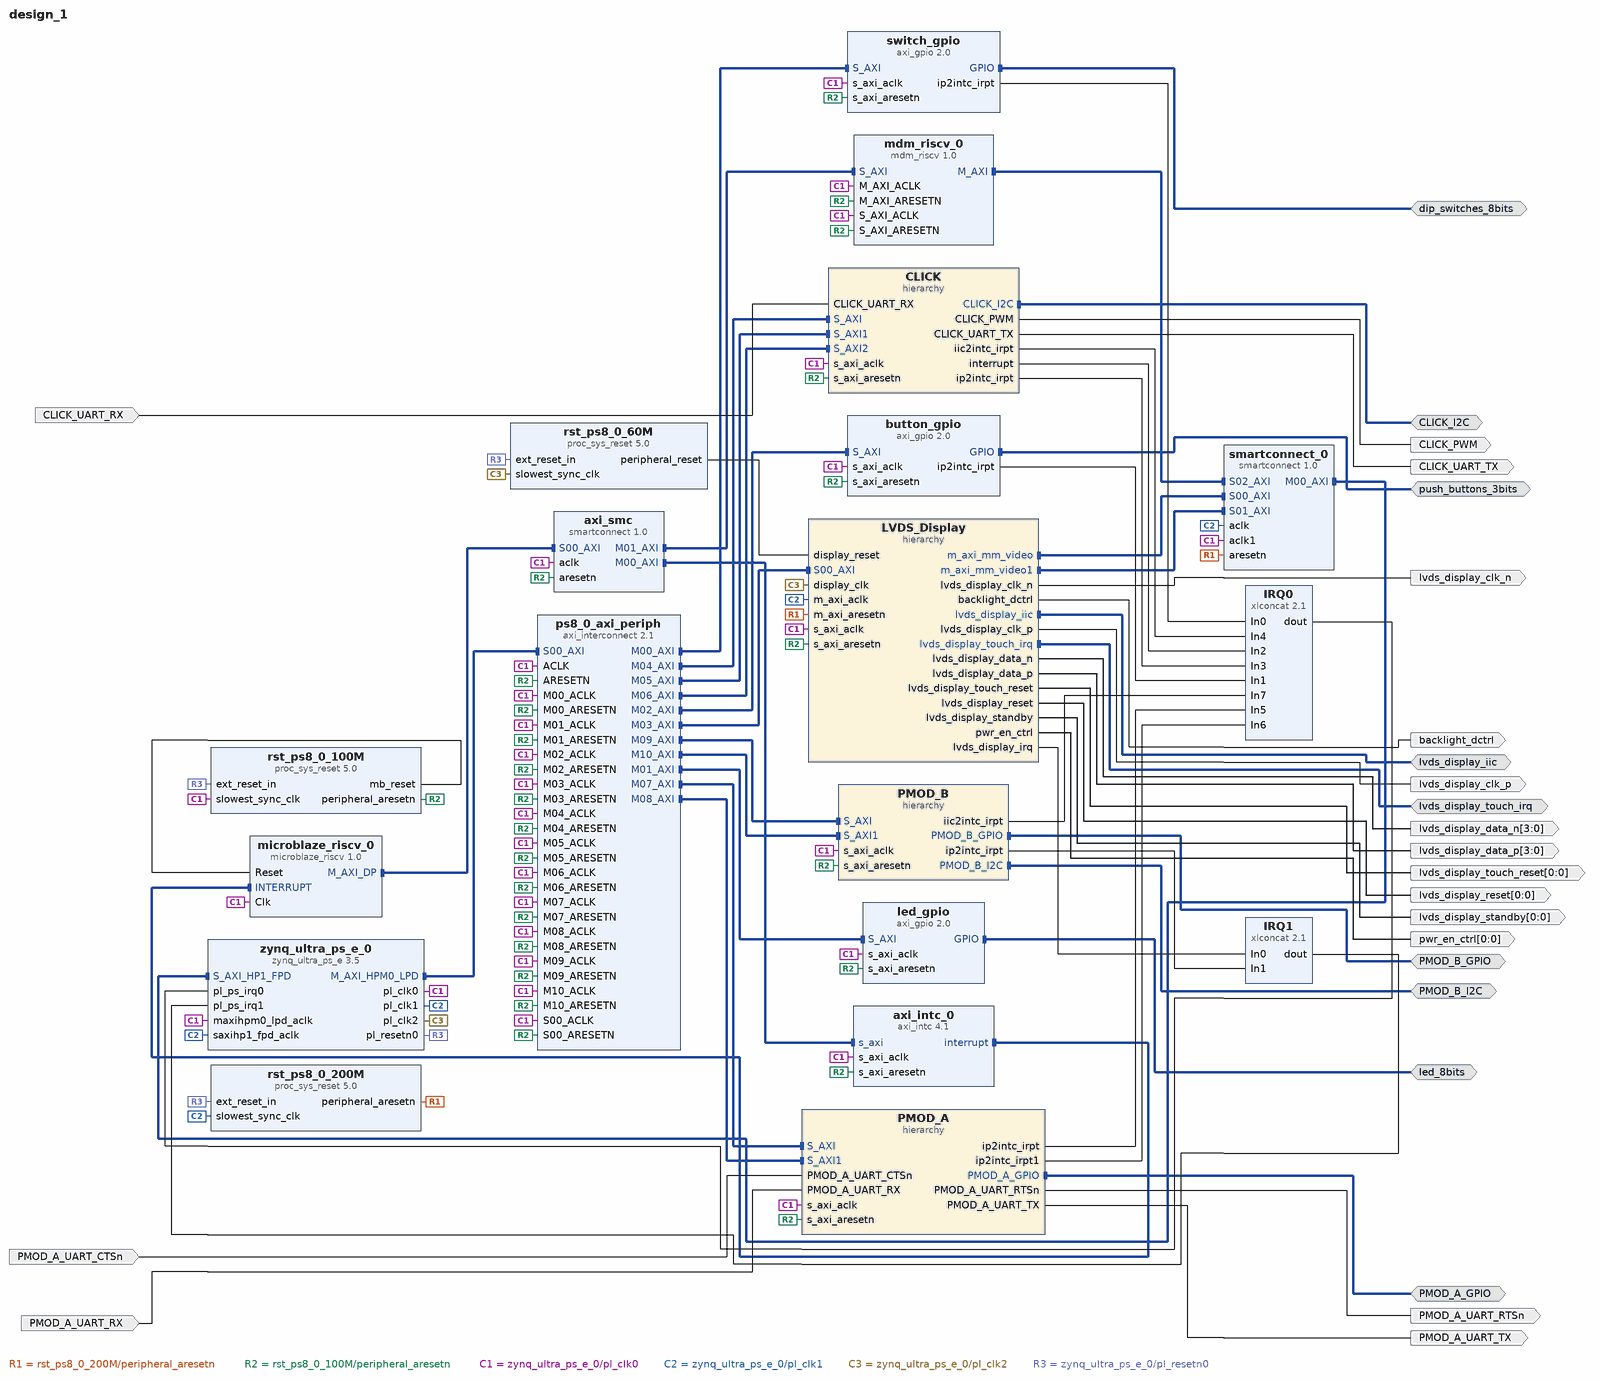
[diagram p0: block diagram of the top level]
# Vivado block design design_1, xczu3eg-sfvc784-1-e, Vivado 2025.1
create_bd_design design_1

create_bd_intf_port -mode Master -vlnv xilinx.com:interface:gpio_rtl:1.0 dip_switches_8bits
create_bd_intf_port -mode Master -vlnv xilinx.com:interface:gpio_rtl:1.0 led_8bits
create_bd_intf_port -mode Master -vlnv xilinx.com:interface:gpio_rtl:1.0 push_buttons_3bits
create_bd_intf_port -mode Master -vlnv xilinx.com:interface:iic_rtl:1.0 lvds_display_iic
create_bd_intf_port -mode Master -vlnv xilinx.com:interface:iic_rtl:1.0 CLICK_I2C
create_bd_intf_port -mode Master -vlnv xilinx.com:interface:iic_rtl:1.0 PMOD_B_I2C
create_bd_intf_port -mode Master -vlnv xilinx.com:interface:gpio_rtl:1.0 PMOD_A_GPIO
create_bd_intf_port -mode Master -vlnv xilinx.com:interface:gpio_rtl:1.0 PMOD_B_GPIO
create_bd_intf_port -mode Master -vlnv xilinx.com:interface:gpio_rtl:1.0 lvds_display_touch_irq
create_bd_port -dir O lvds_display_clk_n
create_bd_port -dir O lvds_display_clk_p
create_bd_port -dir O -from 3 -to 0 lvds_display_data_n
create_bd_port -dir O -from 3 -to 0 lvds_display_data_p
create_bd_port -dir O -from 0 -to 0 lvds_display_reset
create_bd_port -dir O -from 0 -to 0 lvds_display_standby
create_bd_port -dir I PMOD_A_UART_RX
create_bd_port -dir O PMOD_A_UART_TX
create_bd_port -dir I PMOD_A_UART_CTSn
create_bd_port -dir O PMOD_A_UART_RTSn
create_bd_port -dir O backlight_dctrl
create_bd_port -dir O -from 0 -to 0 pwr_en_ctrl
create_bd_port -dir O CLICK_PWM
create_bd_port -dir I CLICK_UART_RX
create_bd_port -dir O CLICK_UART_TX
create_bd_port -dir O -from 0 -to 0 lvds_display_touch_reset

create_bd_cell -type ip -vlnv xilinx.com:ip:proc_sys_reset:5.0 rst_ps8_0_100M
create_bd_cell -type hier LVDS_Display
create_bd_cell -type ip -vlnv xilinx.com:ip:proc_sys_reset:5.0 rst_ps8_0_200M
create_bd_cell -type ip -vlnv xilinx.com:ip:proc_sys_reset:5.0 rst_ps8_0_60M
create_bd_cell -type hier CLICK
create_bd_cell -type hier PMOD_A
create_bd_cell -type hier PMOD_B
create_bd_cell -type ip -vlnv xilinx.com:ip:xlconcat:2.1 IRQ0
set_property -dict {CONFIG.IN2_WIDTH 1 CONFIG.NUM_PORTS 8 CONFIG.dout_width 8} [get_bd_cells IRQ0]
create_bd_cell -type ip -vlnv xilinx.com:ip:xlconcat:2.1 IRQ1
set_property -dict {CONFIG.dout_width 8} [get_bd_cells IRQ1]
create_bd_cell -type ip -vlnv xilinx.com:ip:axi_gpio:2.0 switch_gpio
set_property -dict [list \
  CONFIG.C_INTERRUPT_PRESENT 1 \
  CONFIG.GPIO_BOARD_INTERFACE dip_switches_8bits \
  CONFIG.USE_BOARD_FLOW true \
] [get_bd_cells switch_gpio]
create_bd_cell -type ip -vlnv xilinx.com:ip:axi_gpio:2.0 led_gpio
set_property -dict {CONFIG.GPIO_BOARD_INTERFACE led_8bits CONFIG.USE_BOARD_FLOW true} [get_bd_cells led_gpio]
create_bd_cell -type ip -vlnv xilinx.com:ip:axi_gpio:2.0 button_gpio
set_property -dict [list \
  CONFIG.C_INTERRUPT_PRESENT 1 \
  CONFIG.GPIO_BOARD_INTERFACE push_buttons_3bits \
  CONFIG.USE_BOARD_FLOW true \
] [get_bd_cells button_gpio]
create_bd_cell -type ip -vlnv xilinx.com:ip:axi_interconnect:2.1 ps8_0_axi_periph
set_property -dict {CONFIG.NUM_MI 11} [get_bd_cells ps8_0_axi_periph]
create_bd_cell -type ip -vlnv xilinx.com:ip:smartconnect:1.0 smartconnect_0
set_property -dict {CONFIG.NUM_CLKS 2 CONFIG.NUM_SI 3} [get_bd_cells smartconnect_0]
create_bd_cell -type ip -vlnv xilinx.com:ip:zynq_ultra_ps_e:3.5 zynq_ultra_ps_e_0
set_property -dict [list \
  CONFIG.CAN0_BOARD_INTERFACE custom \
  CONFIG.CAN1_BOARD_INTERFACE custom \
  CONFIG.CSU_BOARD_INTERFACE custom \
  CONFIG.DP_BOARD_INTERFACE custom \
  CONFIG.GEM0_BOARD_INTERFACE custom \
  CONFIG.GEM1_BOARD_INTERFACE custom \
  CONFIG.GEM2_BOARD_INTERFACE custom \
  CONFIG.GEM3_BOARD_INTERFACE custom \
  CONFIG.GPIO_BOARD_INTERFACE custom \
  CONFIG.IIC0_BOARD_INTERFACE custom \
  CONFIG.IIC1_BOARD_INTERFACE custom \
  CONFIG.NAND_BOARD_INTERFACE custom \
  CONFIG.PCIE_BOARD_INTERFACE custom \
  CONFIG.PJTAG_BOARD_INTERFACE custom \
  CONFIG.PMU_BOARD_INTERFACE custom \
  CONFIG.PSU_BANK_0_IO_STANDARD LVCMOS33 \
  CONFIG.PSU_BANK_1_IO_STANDARD LVCMOS33 \
  CONFIG.PSU_BANK_2_IO_STANDARD LVCMOS33 \
  CONFIG.PSU_BANK_3_IO_STANDARD LVCMOS18 \
  CONFIG.PSU_USB3__DUAL_CLOCK_ENABLE 1 \
  CONFIG.PSU__CAN1__PERIPHERAL__ENABLE 0 \
  CONFIG.PSU__CRF_APB__ACPU_CTRL__FREQMHZ 1100 \
  CONFIG.PSU__CRF_APB__ACPU_CTRL__SRCSEL APLL \
  CONFIG.PSU__CRF_APB__APLL_CTRL__SRCSEL PSS_REF_CLK \
  CONFIG.PSU__CRF_APB__DBG_FPD_CTRL__FREQMHZ 250 \
  CONFIG.PSU__CRF_APB__DBG_FPD_CTRL__SRCSEL IOPLL \
  CONFIG.PSU__CRF_APB__DBG_TRACE_CTRL__FREQMHZ 250 \
  CONFIG.PSU__CRF_APB__DBG_TRACE_CTRL__SRCSEL IOPLL \
  CONFIG.PSU__CRF_APB__DBG_TSTMP_CTRL__FREQMHZ 250 \
  CONFIG.PSU__CRF_APB__DBG_TSTMP_CTRL__SRCSEL IOPLL \
  CONFIG.PSU__CRF_APB__DDR_CTRL__FREQMHZ 534 \
  CONFIG.PSU__CRF_APB__DDR_CTRL__SRCSEL DPLL \
  CONFIG.PSU__CRF_APB__DPDMA_REF_CTRL__FREQMHZ 550 \
  CONFIG.PSU__CRF_APB__DPDMA_REF_CTRL__SRCSEL APLL \
  CONFIG.PSU__CRF_APB__DPLL_CTRL__SRCSEL PSS_REF_CLK \
  CONFIG.PSU__CRF_APB__DP_AUDIO_REF_CTRL__SRCSEL RPLL \
  CONFIG.PSU__CRF_APB__DP_STC_REF_CTRL__SRCSEL RPLL \
  CONFIG.PSU__CRF_APB__DP_VIDEO_REF_CTRL__SRCSEL VPLL \
  CONFIG.PSU__CRF_APB__GDMA_REF_CTRL__FREQMHZ 550 \
  CONFIG.PSU__CRF_APB__GDMA_REF_CTRL__SRCSEL APLL \
  CONFIG.PSU__CRF_APB__GPU_REF_CTRL__FREQMHZ 500 \
  CONFIG.PSU__CRF_APB__GPU_REF_CTRL__SRCSEL IOPLL \
  CONFIG.PSU__CRF_APB__TOPSW_LSBUS_CTRL__FREQMHZ 100 \
  CONFIG.PSU__CRF_APB__TOPSW_LSBUS_CTRL__SRCSEL IOPLL \
  CONFIG.PSU__CRF_APB__TOPSW_MAIN_CTRL__FREQMHZ 475 \
  CONFIG.PSU__CRF_APB__TOPSW_MAIN_CTRL__SRCSEL DPLL \
  CONFIG.PSU__CRF_APB__VPLL_CTRL__SRCSEL PSS_REF_CLK \
  CONFIG.PSU__CRL_APB__ADMA_REF_CTRL__FREQMHZ 500 \
  CONFIG.PSU__CRL_APB__ADMA_REF_CTRL__SRCSEL IOPLL \
  CONFIG.PSU__CRL_APB__CAN1_REF_CTRL__FREQMHZ 100 \
  CONFIG.PSU__CRL_APB__CAN1_REF_CTRL__SRCSEL IOPLL \
  CONFIG.PSU__CRL_APB__CPU_R5_CTRL__FREQMHZ 500 \
  CONFIG.PSU__CRL_APB__CPU_R5_CTRL__SRCSEL IOPLL \
  CONFIG.PSU__CRL_APB__DBG_LPD_CTRL__FREQMHZ 250 \
  CONFIG.PSU__CRL_APB__DBG_LPD_CTRL__SRCSEL IOPLL \
  CONFIG.PSU__CRL_APB__GEM3_REF_CTRL__FREQMHZ 125 \
  CONFIG.PSU__CRL_APB__GEM3_REF_CTRL__SRCSEL IOPLL \
  CONFIG.PSU__CRL_APB__I2C0_REF_CTRL__FREQMHZ 100 \
  CONFIG.PSU__CRL_APB__I2C0_REF_CTRL__SRCSEL IOPLL \
  CONFIG.PSU__CRL_APB__I2C1_REF_CTRL__FREQMHZ 100 \
  CONFIG.PSU__CRL_APB__I2C1_REF_CTRL__SRCSEL IOPLL \
  CONFIG.PSU__CRL_APB__IOPLL_CTRL__SRCSEL PSS_REF_CLK \
  CONFIG.PSU__CRL_APB__IOU_SWITCH_CTRL__FREQMHZ 250 \
  CONFIG.PSU__CRL_APB__IOU_SWITCH_CTRL__SRCSEL IOPLL \
  CONFIG.PSU__CRL_APB__LPD_LSBUS_CTRL__FREQMHZ 100 \
  CONFIG.PSU__CRL_APB__LPD_LSBUS_CTRL__SRCSEL IOPLL \
  CONFIG.PSU__CRL_APB__LPD_SWITCH_CTRL__FREQMHZ 500 \
  CONFIG.PSU__CRL_APB__LPD_SWITCH_CTRL__SRCSEL IOPLL \
  CONFIG.PSU__CRL_APB__PCAP_CTRL__FREQMHZ 200 \
  CONFIG.PSU__CRL_APB__PCAP_CTRL__SRCSEL RPLL \
  CONFIG.PSU__CRL_APB__PL0_REF_CTRL__FREQMHZ 100 \
  CONFIG.PSU__CRL_APB__PL0_REF_CTRL__SRCSEL IOPLL \
  CONFIG.PSU__CRL_APB__PL1_REF_CTRL__FREQMHZ 200 \
  CONFIG.PSU__CRL_APB__PL2_REF_CTRL__FREQMHZ 60 \
  CONFIG.PSU__CRL_APB__QSPI_REF_CTRL__FREQMHZ 125 \
  CONFIG.PSU__CRL_APB__QSPI_REF_CTRL__SRCSEL IOPLL \
  CONFIG.PSU__CRL_APB__RPLL_CTRL__SRCSEL PSS_REF_CLK \
  CONFIG.PSU__CRL_APB__SDIO1_REF_CTRL__FREQMHZ 200 \
  CONFIG.PSU__CRL_APB__SDIO1_REF_CTRL__SRCSEL RPLL \
  CONFIG.PSU__CRL_APB__TIMESTAMP_REF_CTRL__FREQMHZ 100 \
  CONFIG.PSU__CRL_APB__TIMESTAMP_REF_CTRL__SRCSEL IOPLL \
  CONFIG.PSU__CRL_APB__UART0_REF_CTRL__FREQMHZ 100 \
  CONFIG.PSU__CRL_APB__UART0_REF_CTRL__SRCSEL IOPLL \
  CONFIG.PSU__CRL_APB__UART1_REF_CTRL__FREQMHZ 100 \
  CONFIG.PSU__CRL_APB__UART1_REF_CTRL__SRCSEL IOPLL \
  CONFIG.PSU__CRL_APB__USB0_BUS_REF_CTRL__FREQMHZ 250 \
  CONFIG.PSU__CRL_APB__USB0_BUS_REF_CTRL__SRCSEL IOPLL \
  CONFIG.PSU__CRL_APB__USB3_DUAL_REF_CTRL__FREQMHZ 20 \
  CONFIG.PSU__CRL_APB__USB3_DUAL_REF_CTRL__SRCSEL IOPLL \
  CONFIG.PSU__CRL_APB__USB3__ENABLE 1 \
  CONFIG.PSU__CSUPMU__PERIPHERAL__VALID 0 \
  CONFIG.PSU__DDRC__BUS_WIDTH {32 Bit} \
  CONFIG.PSU__DDRC__DEVICE_CAPACITY {16384 MBits} \
  CONFIG.PSU__DDRC__DRAM_WIDTH {32 Bits} \
  CONFIG.PSU__DDRC__ECC Disabled \
  CONFIG.PSU__DDRC__MEMORY_TYPE {LPDDR 4} \
  CONFIG.PSU__DDRC__SPEED_BIN LPDDR4_1066 \
  CONFIG.PSU__DDR_HIGH_ADDRESS_GUI_ENABLE 0 \
  CONFIG.PSU__DDR__INTERFACE__FREQMHZ 267.000 \
  CONFIG.PSU__DEVICE_TYPE EG \
  CONFIG.PSU__DISPLAYPORT__LANE0__ENABLE 1 \
  CONFIG.PSU__DISPLAYPORT__LANE0__IO {GT Lane1} \
  CONFIG.PSU__DISPLAYPORT__LANE1__ENABLE 1 \
  CONFIG.PSU__DISPLAYPORT__LANE1__IO {GT Lane0} \
  CONFIG.PSU__DISPLAYPORT__PERIPHERAL__ENABLE 1 \
  CONFIG.PSU__DLL__ISUSED 1 \
  CONFIG.PSU__DPAUX__PERIPHERAL__ENABLE 1 \
  CONFIG.PSU__DPAUX__PERIPHERAL__IO {MIO 27 .. 30} \
  CONFIG.PSU__DP__LANE_SEL {Dual Lower} \
  CONFIG.PSU__DP__REF_CLK_FREQ 27 \
  CONFIG.PSU__DP__REF_CLK_SEL {Ref Clk1} \
  CONFIG.PSU__ENET3__FIFO__ENABLE 0 \
  CONFIG.PSU__ENET3__GRP_MDIO__ENABLE 1 \
  CONFIG.PSU__ENET3__GRP_MDIO__IO {MIO 76 .. 77} \
  CONFIG.PSU__ENET3__PERIPHERAL__ENABLE 1 \
  CONFIG.PSU__ENET3__PERIPHERAL__IO {MIO 64 .. 75} \
  CONFIG.PSU__ENET3__PTP__ENABLE 0 \
  CONFIG.PSU__ENET3__TSU__ENABLE 0 \
  CONFIG.PSU__FPGA_PL0_ENABLE 1 \
  CONFIG.PSU__FPGA_PL1_ENABLE 1 \
  CONFIG.PSU__FPGA_PL2_ENABLE 1 \
  CONFIG.PSU__GEM3_COHERENCY 0 \
  CONFIG.PSU__GEM3_ROUTE_THROUGH_FPD 0 \
  CONFIG.PSU__GEM__TSU__ENABLE 0 \
  CONFIG.PSU__GPIO0_MIO__IO {MIO 0 .. 25} \
  CONFIG.PSU__GPIO0_MIO__PERIPHERAL__ENABLE 1 \
  CONFIG.PSU__GPIO1_MIO__IO {MIO 26 .. 51} \
  CONFIG.PSU__GPIO1_MIO__PERIPHERAL__ENABLE 1 \
  CONFIG.PSU__GT__LINK_SPEED HBR \
  CONFIG.PSU__GT__PRE_EMPH_LVL_4 0 \
  CONFIG.PSU__GT__VLT_SWNG_LVL_4 0 \
  CONFIG.PSU__I2C0__PERIPHERAL__ENABLE 0 \
  CONFIG.PSU__I2C1__PERIPHERAL__ENABLE 1 \
  CONFIG.PSU__I2C1__PERIPHERAL__IO {MIO 24 .. 25} \
  CONFIG.PSU__IOU_SLCR__IOU_TTC_APB_CLK__TTC0_SEL APB \
  CONFIG.PSU__IOU_SLCR__IOU_TTC_APB_CLK__TTC1_SEL APB \
  CONFIG.PSU__IOU_SLCR__IOU_TTC_APB_CLK__TTC2_SEL APB \
  CONFIG.PSU__IOU_SLCR__IOU_TTC_APB_CLK__TTC3_SEL APB \
  CONFIG.PSU__LPD_SLCR__CSUPMU__FREQMHZ 100 \
  CONFIG.PSU__MAXIGP2__DATA_WIDTH 64 \
  CONFIG.PSU__OVERRIDE_HPX_QOS 0 \
  CONFIG.PSU__OVERRIDE__BASIC_CLOCK 0 \
  CONFIG.PSU__PCIE__CLASS_CODE_BASE 0x06 \
  CONFIG.PSU__PCIE__CLASS_CODE_INTERFACE 0x0 \
  CONFIG.PSU__PCIE__CLASS_CODE_SUB 0x4 \
  CONFIG.PSU__PCIE__DEVICE_ID 0xD021 \
  CONFIG.PSU__PCIE__INTX_PIN INTA \
  CONFIG.PSU__PCIE__REVISION_ID 0x0 \
  CONFIG.PSU__PCIE__SUBSYSTEM_ID 0x7 \
  CONFIG.PSU__PCIE__SUBSYSTEM_VENDOR_ID 0x10EE \
  CONFIG.PSU__PCIE__VENDOR_ID 0x10EE \
  CONFIG.PSU__PMU__PERIPHERAL__ENABLE 0 \
  CONFIG.PSU__PRESET_APPLIED 0 \
  CONFIG.PSU__PSS_REF_CLK__FREQMHZ 33.333 \
  CONFIG.PSU__QSPI_COHERENCY 0 \
  CONFIG.PSU__QSPI_ROUTE_THROUGH_FPD 0 \
  CONFIG.PSU__QSPI__GRP_FBCLK__ENABLE 0 \
  CONFIG.PSU__QSPI__PERIPHERAL__DATA_MODE x4 \
  CONFIG.PSU__QSPI__PERIPHERAL__ENABLE 1 \
  CONFIG.PSU__QSPI__PERIPHERAL__IO {MIO 0 .. 12} \
  CONFIG.PSU__QSPI__PERIPHERAL__MODE {Dual Parallel} \
  CONFIG.PSU__SATA__LANE1__IO {GT Lane3} \
  CONFIG.PSU__SATA__PERIPHERAL__ENABLE 1 \
  CONFIG.PSU__SATA__REF_CLK_FREQ 125 \
  CONFIG.PSU__SATA__REF_CLK_SEL {Ref Clk3} \
  CONFIG.PSU__SD0__CLK_200_SDR_OTAP_DLY 0x3 \
  CONFIG.PSU__SD0__CLK_50_DDR_ITAP_DLY 0x12 \
  CONFIG.PSU__SD0__CLK_50_DDR_OTAP_DLY 0x6 \
  CONFIG.PSU__SD0__CLK_50_SDR_ITAP_DLY 0x15 \
  CONFIG.PSU__SD0__CLK_50_SDR_OTAP_DLY 0x6 \
  CONFIG.PSU__SD0__DATA_TRANSFER_MODE 8Bit \
  CONFIG.PSU__SD0__PERIPHERAL__ENABLE 1 \
  CONFIG.PSU__SD0__PERIPHERAL__IO {MIO 13 .. 22} \
  CONFIG.PSU__SD0__SLOT_TYPE eMMC \
  CONFIG.PSU__SD1_COHERENCY 0 \
  CONFIG.PSU__SD1_ROUTE_THROUGH_FPD 0 \
  CONFIG.PSU__SD1__CLK_50_SDR_ITAP_DLY 0x15 \
  CONFIG.PSU__SD1__CLK_50_SDR_OTAP_DLY 0x5 \
  CONFIG.PSU__SD1__DATA_TRANSFER_MODE 4Bit \
  CONFIG.PSU__SD1__GRP_CD__ENABLE 0 \
  CONFIG.PSU__SD1__GRP_POW__ENABLE 0 \
  CONFIG.PSU__SD1__GRP_WP__ENABLE 1 \
  CONFIG.PSU__SD1__GRP_WP__IO {MIO 44} \
  CONFIG.PSU__SD1__PERIPHERAL__ENABLE 1 \
  CONFIG.PSU__SD1__PERIPHERAL__IO {MIO 46 .. 51} \
  CONFIG.PSU__SD1__SLOT_TYPE {SD 2.0} \
  CONFIG.PSU__SPI0__GRP_SS0__IO {MIO 41} \
  CONFIG.PSU__SPI0__GRP_SS1__ENABLE 1 \
  CONFIG.PSU__SPI0__GRP_SS1__IO {MIO 40} \
  CONFIG.PSU__SPI0__GRP_SS2__ENABLE 1 \
  CONFIG.PSU__SPI0__GRP_SS2__IO {MIO 39} \
  CONFIG.PSU__SPI0__PERIPHERAL__ENABLE 1 \
  CONFIG.PSU__SPI0__PERIPHERAL__IO {MIO 38 .. 43} \
  CONFIG.PSU__SWDT0__CLOCK__ENABLE 0 \
  CONFIG.PSU__SWDT0__PERIPHERAL__ENABLE 1 \
  CONFIG.PSU__SWDT0__RESET__ENABLE 0 \
  CONFIG.PSU__SWDT1__CLOCK__ENABLE 0 \
  CONFIG.PSU__SWDT1__PERIPHERAL__ENABLE 1 \
  CONFIG.PSU__SWDT1__RESET__ENABLE 0 \
  CONFIG.PSU__TSU__BUFG_PORT_PAIR 0 \
  CONFIG.PSU__TTC0__CLOCK__ENABLE 0 \
  CONFIG.PSU__TTC0__PERIPHERAL__ENABLE 1 \
  CONFIG.PSU__TTC0__WAVEOUT__ENABLE 0 \
  CONFIG.PSU__TTC1__CLOCK__ENABLE 0 \
  CONFIG.PSU__TTC1__PERIPHERAL__ENABLE 1 \
  CONFIG.PSU__TTC1__WAVEOUT__ENABLE 0 \
  CONFIG.PSU__TTC2__CLOCK__ENABLE 0 \
  CONFIG.PSU__TTC2__PERIPHERAL__ENABLE 1 \
  CONFIG.PSU__TTC2__WAVEOUT__ENABLE 0 \
  CONFIG.PSU__TTC3__CLOCK__ENABLE 0 \
  CONFIG.PSU__TTC3__PERIPHERAL__ENABLE 1 \
  CONFIG.PSU__TTC3__WAVEOUT__ENABLE 0 \
  CONFIG.PSU__UART0__BAUD_RATE 115200 \
  CONFIG.PSU__UART0__MODEM__ENABLE 0 \
  CONFIG.PSU__UART0__PERIPHERAL__ENABLE 1 \
  CONFIG.PSU__UART0__PERIPHERAL__IO {MIO 34 .. 35} \
  CONFIG.PSU__UART1__BAUD_RATE 115200 \
  CONFIG.PSU__UART1__MODEM__ENABLE 0 \
  CONFIG.PSU__UART1__PERIPHERAL__ENABLE 1 \
  CONFIG.PSU__UART1__PERIPHERAL__IO {MIO 32 .. 33} \
  CONFIG.PSU__USB0_COHERENCY 0 \
  CONFIG.PSU__USB0__PERIPHERAL__ENABLE 1 \
  CONFIG.PSU__USB0__PERIPHERAL__IO {MIO 52 .. 63} \
  CONFIG.PSU__USB0__REF_CLK_FREQ 52 \
  CONFIG.PSU__USB0__REF_CLK_SEL {Ref Clk2} \
  CONFIG.PSU__USB2_0__EMIO__ENABLE 0 \
  CONFIG.PSU__USB3_0__EMIO__ENABLE 0 \
  CONFIG.PSU__USB3_0__PERIPHERAL__ENABLE 1 \
  CONFIG.PSU__USB3_0__PERIPHERAL__IO {GT Lane2} \
  CONFIG.PSU__USB__RESET__MODE {Boot Pin} \
  CONFIG.PSU__USB__RESET__POLARITY {Active Low} \
  CONFIG.PSU__USE__IRQ0 1 \
  CONFIG.PSU__USE__IRQ1 1 \
  CONFIG.PSU__USE__M_AXI_GP0 0 \
  CONFIG.PSU__USE__M_AXI_GP1 0 \
  CONFIG.PSU__USE__M_AXI_GP2 1 \
  CONFIG.PSU__USE__S_AXI_GP3 1 \
  CONFIG.QSPI_BOARD_INTERFACE custom \
  CONFIG.SATA_BOARD_INTERFACE custom \
  CONFIG.SD0_BOARD_INTERFACE custom \
  CONFIG.SD1_BOARD_INTERFACE custom \
  CONFIG.SPI0_BOARD_INTERFACE custom \
  CONFIG.SPI1_BOARD_INTERFACE custom \
  CONFIG.SUBPRESET1 Custom \
  CONFIG.SUBPRESET2 Custom \
  CONFIG.SWDT0_BOARD_INTERFACE custom \
  CONFIG.SWDT1_BOARD_INTERFACE custom \
  CONFIG.TRACE_BOARD_INTERFACE custom \
  CONFIG.TTC0_BOARD_INTERFACE custom \
  CONFIG.TTC1_BOARD_INTERFACE custom \
  CONFIG.TTC2_BOARD_INTERFACE custom \
  CONFIG.TTC3_BOARD_INTERFACE custom \
  CONFIG.UART0_BOARD_INTERFACE custom \
  CONFIG.UART1_BOARD_INTERFACE custom \
  CONFIG.USB0_BOARD_INTERFACE custom \
  CONFIG.USB1_BOARD_INTERFACE custom \
  CONFIG.preset None \
] [get_bd_cells zynq_ultra_ps_e_0]
# 742 more settings of zynq_ultra_ps_e_0 are not shown: defaults, MIO pin electricals, DDR timing, and values the tool derives
create_bd_cell -type ip -vlnv xilinx.com:ip:mdm_riscv:1.0 mdm_riscv_0
set_property -dict [list \
  CONFIG.C_ADDR_SIZE 32 \
  CONFIG.C_DBG_MEM_ACCESS 1 \
  CONFIG.C_M_AXI_ADDR_WIDTH 32 \
  CONFIG.C_USE_UART 1 \
] [get_bd_cells mdm_riscv_0]
create_bd_cell -type ip -vlnv xilinx.com:ip:microblaze_riscv:1.0 microblaze_riscv_0
set_property -dict [list \
  CONFIG.C_DEBUG_EXTERNAL_TRACE 0 \
  CONFIG.C_DEBUG_INTERFACE 0 \
  CONFIG.C_D_AXI 1 \
  CONFIG.C_ENABLE_DISCRETE_PORTS 0 \
  CONFIG.C_I_AXI 1 \
  CONFIG.C_TRACE 0 \
  CONFIG.C_USE_DCACHE 0 \
  CONFIG.C_USE_ICACHE 0 \
] [get_bd_cells microblaze_riscv_0]
create_bd_cell -type ip -vlnv xilinx.com:ip:axi_intc:4.1 axi_intc_0
create_bd_cell -type ip -vlnv xilinx.com:ip:smartconnect:1.0 axi_smc
set_property -dict {CONFIG.NUM_MI 2 CONFIG.NUM_SI 1} [get_bd_cells axi_smc]

# ---- hierarchy /LVDS_Display ----
current_bd_instance /LVDS_Display
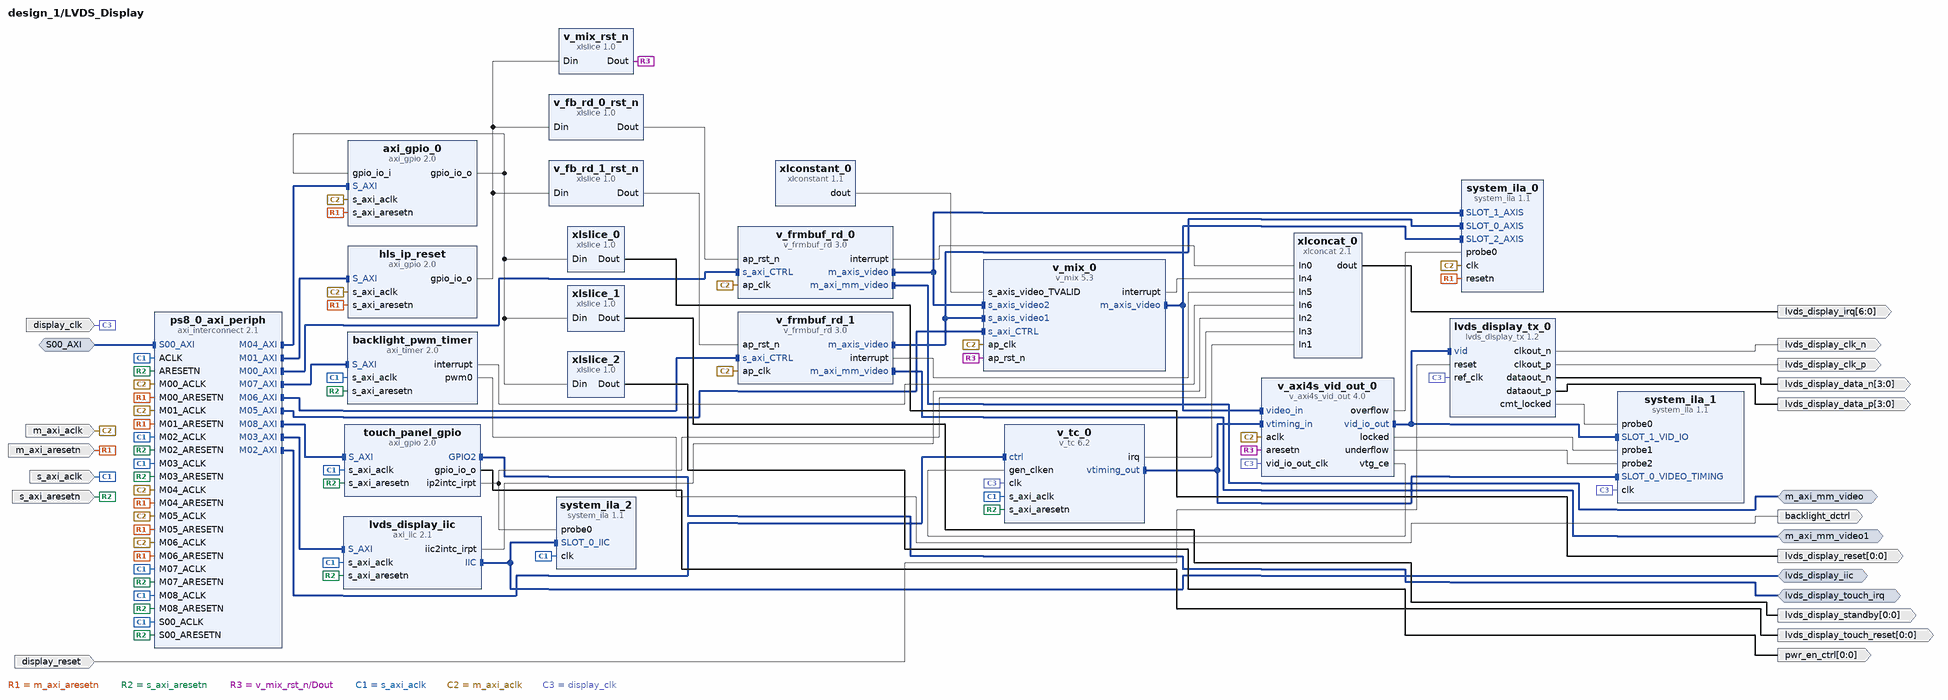
[diagram p1: block diagram inside /LVDS_Display]
create_bd_intf_pin -mode Slave -vlnv xilinx.com:interface:aximm_rtl:1.0 S00_AXI
create_bd_intf_pin -mode Master -vlnv xilinx.com:interface:iic_rtl:1.0 lvds_display_iic
create_bd_intf_pin -mode Master -vlnv xilinx.com:interface:aximm_rtl:1.0 m_axi_mm_video
create_bd_intf_pin -mode Master -vlnv xilinx.com:interface:aximm_rtl:1.0 m_axi_mm_video1
create_bd_intf_pin -mode Master -vlnv xilinx.com:interface:gpio_rtl:1.0 lvds_display_touch_irq
create_bd_pin -dir I -type clk display_clk
create_bd_pin -dir I -type rst display_reset
create_bd_pin -dir O lvds_display_clk_n
create_bd_pin -dir O lvds_display_clk_p
create_bd_pin -dir O -from 3 -to 0 lvds_display_data_n
create_bd_pin -dir O -from 3 -to 0 lvds_display_data_p
create_bd_pin -dir O -from 6 -to 0 lvds_display_irq
create_bd_pin -dir O -from 0 -to 0 lvds_display_reset
create_bd_pin -dir O -from 0 -to 0 lvds_display_standby
create_bd_pin -dir I -type clk m_axi_aclk
create_bd_pin -dir I -type rst m_axi_aresetn
create_bd_pin -dir I -type clk s_axi_aclk
create_bd_pin -dir I -type rst s_axi_aresetn
create_bd_pin -dir O backlight_dctrl
create_bd_pin -dir O -from 0 -to 0 pwr_en_ctrl
create_bd_pin -dir O -from 0 -to 0 lvds_display_touch_reset

create_bd_cell -type ip -vlnv designlinxhs.com:user:lvds_display_tx:1.2 lvds_display_tx_0
set_property -dict {CONFIG.PIXEL_FORMAT RBG CONFIG.USE_ALPHA 3} [get_bd_cells lvds_display_tx_0]
create_bd_cell -type ip -vlnv xilinx.com:ip:xlslice:1.0 v_fb_rd_0_rst_n
set_property -dict {CONFIG.DIN_FROM 2 CONFIG.DIN_TO 2 CONFIG.DIN_WIDTH 3 CONFIG.DOUT_WIDTH 1} [get_bd_cells v_fb_rd_0_rst_n]
create_bd_cell -type ip -vlnv xilinx.com:ip:xlslice:1.0 v_fb_rd_1_rst_n
set_property -dict {CONFIG.DIN_FROM 1 CONFIG.DIN_TO 1 CONFIG.DIN_WIDTH 3 CONFIG.DOUT_WIDTH 1} [get_bd_cells v_fb_rd_1_rst_n]
create_bd_cell -type ip -vlnv xilinx.com:ip:xlslice:1.0 v_mix_rst_n
set_property -dict {CONFIG.DIN_WIDTH 3} [get_bd_cells v_mix_rst_n]
create_bd_cell -type ip -vlnv xilinx.com:ip:xlconcat:2.1 xlconcat_0
set_property -dict {CONFIG.NUM_PORTS 7 CONFIG.dout_width 7} [get_bd_cells xlconcat_0]
create_bd_cell -type ip -vlnv xilinx.com:ip:xlconstant:1.1 xlconstant_0
set_property -dict {CONFIG.CONST_VAL 0} [get_bd_cells xlconstant_0]
create_bd_cell -type ip -vlnv xilinx.com:ip:xlslice:1.0 xlslice_0
set_property -dict {CONFIG.DIN_WIDTH 3} [get_bd_cells xlslice_0]
create_bd_cell -type ip -vlnv xilinx.com:ip:xlslice:1.0 xlslice_1
set_property -dict {CONFIG.DIN_FROM 1 CONFIG.DIN_TO 1 CONFIG.DIN_WIDTH 3 CONFIG.DOUT_WIDTH 1} [get_bd_cells xlslice_1]
create_bd_cell -type ip -vlnv xilinx.com:ip:xlslice:1.0 xlslice_2
set_property -dict {CONFIG.DIN_FROM 2 CONFIG.DIN_TO 2 CONFIG.DIN_WIDTH 3 CONFIG.DOUT_WIDTH 1} [get_bd_cells xlslice_2]
create_bd_cell -type ip -vlnv xilinx.com:ip:axi_gpio:2.0 axi_gpio_0
set_property -dict {CONFIG.C_GPIO_WIDTH 3} [get_bd_cells axi_gpio_0]
create_bd_cell -type ip -vlnv xilinx.com:ip:axi_gpio:2.0 touch_panel_gpio
set_property -dict [list \
  CONFIG.C_ALL_INPUTS_2 0 \
  CONFIG.C_ALL_OUTPUTS 1 \
  CONFIG.C_GPIO2_WIDTH 1 \
  CONFIG.C_GPIO_WIDTH 1 \
  CONFIG.C_INTERRUPT_PRESENT 1 \
  CONFIG.C_IS_DUAL 1 \
] [get_bd_cells touch_panel_gpio]
create_bd_cell -type ip -vlnv xilinx.com:ip:axi_timer:2.0 backlight_pwm_timer
create_bd_cell -type ip -vlnv xilinx.com:ip:axi_gpio:2.0 hls_ip_reset
set_property -dict {CONFIG.C_ALL_OUTPUTS 1 CONFIG.C_DOUT_DEFAULT 0x00000000 CONFIG.C_GPIO_WIDTH 3} [get_bd_cells hls_ip_reset]
create_bd_cell -type ip -vlnv xilinx.com:ip:axi_iic:2.1 lvds_display_iic
create_bd_cell -type ip -vlnv xilinx.com:ip:axi_interconnect:2.1 ps8_0_axi_periph
set_property -dict {CONFIG.NUM_MI 9} [get_bd_cells ps8_0_axi_periph]
create_bd_cell -type ip -vlnv xilinx.com:ip:system_ila:1.1 system_ila_0
set_property -dict [list \
  CONFIG.C_DATA_DEPTH 8192 \
  CONFIG.C_MON_TYPE MIX \
  CONFIG.C_NUM_MONITOR_SLOTS 3 \
  CONFIG.C_NUM_OF_PROBES 1 \
  CONFIG.C_SLOT 2 \
  CONFIG.C_SLOT_0_INTF_TYPE xilinx.com:interface:axis_rtl:1.0 \
  CONFIG.C_SLOT_1_INTF_TYPE xilinx.com:interface:axis_rtl:1.0 \
  CONFIG.C_SLOT_2_INTF_TYPE xilinx.com:interface:axis_rtl:1.0 \
  CONFIG.C_SLOT_3_INTF_TYPE xilinx.com:interface:vid_io_rtl:1.0 \
] [get_bd_cells system_ila_0]
create_bd_cell -type ip -vlnv xilinx.com:ip:system_ila:1.1 system_ila_1
set_property -dict [list \
  CONFIG.C_DATA_DEPTH 8192 \
  CONFIG.C_MON_TYPE MIX \
  CONFIG.C_NUM_MONITOR_SLOTS 2 \
  CONFIG.C_NUM_OF_PROBES 3 \
  CONFIG.C_SLOT 1 \
  CONFIG.C_SLOT_0_INTF_TYPE xilinx.com:interface:video_timing_rtl:2.0 \
  CONFIG.C_SLOT_1_INTF_TYPE xilinx.com:interface:vid_io_rtl:1.0 \
] [get_bd_cells system_ila_1]
create_bd_cell -type ip -vlnv xilinx.com:ip:system_ila:1.1 system_ila_2
set_property -dict [list \
  CONFIG.C_DATA_DEPTH 32768 \
  CONFIG.C_MON_TYPE MIX \
  CONFIG.C_SLOT_0_INTF_TYPE xilinx.com:interface:iic_rtl:1.0 \
] [get_bd_cells system_ila_2]
create_bd_cell -type ip -vlnv xilinx.com:ip:v_axi4s_vid_out:4.0 v_axi4s_vid_out_0
set_property -dict {CONFIG.C_HAS_ASYNC_CLK 1 CONFIG.C_S_AXIS_VIDEO_FORMAT 2} [get_bd_cells v_axi4s_vid_out_0]
create_bd_cell -type ip -vlnv xilinx.com:ip:v_frmbuf_rd:3.0 v_frmbuf_rd_0
set_property -dict [list \
  CONFIG.AXIMM_DATA_WIDTH 64 \
  CONFIG.C_M_AXI_MM_VIDEO_DATA_WIDTH 64 \
  CONFIG.HAS_ALPHA 1 \
  CONFIG.HAS_BGRA8 1 \
  CONFIG.HAS_RGBA8 1 \
  CONFIG.NUM_VIDEO_COMPONENTS 4 \
  CONFIG.SAMPLES_PER_CLOCK 1 \
] [get_bd_cells v_frmbuf_rd_0]
create_bd_cell -type ip -vlnv xilinx.com:ip:v_frmbuf_rd:3.0 v_frmbuf_rd_1
set_property -dict [list \
  CONFIG.AXIMM_DATA_WIDTH 64 \
  CONFIG.C_M_AXI_MM_VIDEO_DATA_WIDTH 64 \
  CONFIG.HAS_ALPHA 0 \
  CONFIG.HAS_BGR8 0 \
  CONFIG.HAS_BGRX8 0 \
  CONFIG.HAS_RGB8 0 \
  CONFIG.HAS_RGBX8 0 \
  CONFIG.HAS_UYVY8 1 \
  CONFIG.HAS_YUV8 0 \
  CONFIG.HAS_YUVX8 0 \
  CONFIG.HAS_YUYV8 1 \
  CONFIG.HAS_Y_UV8 1 \
  CONFIG.HAS_Y_UV8_420 0 \
  CONFIG.MAX_NR_PLANES 2 \
  CONFIG.NUM_VIDEO_COMPONENTS 3 \
  CONFIG.SAMPLES_PER_CLOCK 1 \
] [get_bd_cells v_frmbuf_rd_1]
create_bd_cell -type ip -vlnv xilinx.com:ip:v_mix:5.3 v_mix_0
set_property -dict [list \
  CONFIG.ENABLE_CSC_COEFFICIENT_REGISTERS 0 \
  CONFIG.LAYER1_ALPHA false \
  CONFIG.LAYER1_INTF_TYPE 1 \
  CONFIG.LAYER1_VIDEO_FORMAT 2 \
  CONFIG.LAYER2_INTF_TYPE 1 \
  CONFIG.LAYER2_VIDEO_FORMAT 5 \
  CONFIG.LOGO_LAYER false \
  CONFIG.LOGO_TRANSPARENCY_COLOR false \
  CONFIG.NR_LAYERS 3 \
] [get_bd_cells v_mix_0]
create_bd_cell -type ip -vlnv xilinx.com:ip:v_tc:6.2 v_tc_0
set_property -dict {CONFIG.enable_detection false CONFIG.max_clocks_per_line 8192} [get_bd_cells v_tc_0]

# ---- hierarchy /CLICK ----
current_bd_instance /CLICK
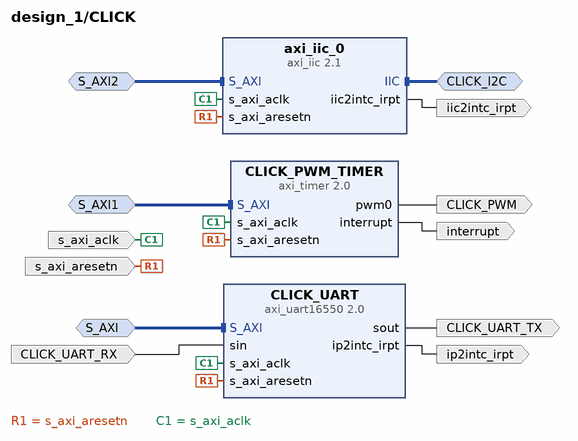
[diagram p2: block diagram inside /CLICK]
create_bd_intf_pin -mode Slave -vlnv xilinx.com:interface:aximm_rtl:1.0 S_AXI
create_bd_intf_pin -mode Slave -vlnv xilinx.com:interface:aximm_rtl:1.0 S_AXI1
create_bd_intf_pin -mode Slave -vlnv xilinx.com:interface:aximm_rtl:1.0 S_AXI2
create_bd_intf_pin -mode Master -vlnv xilinx.com:interface:iic_rtl:1.0 CLICK_I2C
create_bd_pin -dir I -type clk s_axi_aclk
create_bd_pin -dir I -type rst s_axi_aresetn
create_bd_pin -dir O -type intr ip2intc_irpt
create_bd_pin -dir I CLICK_UART_RX
create_bd_pin -dir O CLICK_UART_TX
create_bd_pin -dir O CLICK_PWM
create_bd_pin -dir O -type intr interrupt
create_bd_pin -dir O -type intr iic2intc_irpt

create_bd_cell -type ip -vlnv xilinx.com:ip:axi_iic:2.1 axi_iic_0
create_bd_cell -type ip -vlnv xilinx.com:ip:axi_timer:2.0 CLICK_PWM_TIMER
create_bd_cell -type ip -vlnv xilinx.com:ip:axi_uart16550:2.0 CLICK_UART
set_property -dict {CONFIG.C_S_AXI_ACLK_FREQ_HZ 99999001} [get_bd_cells CLICK_UART]

# ---- hierarchy /PMOD_A ----
current_bd_instance /PMOD_A
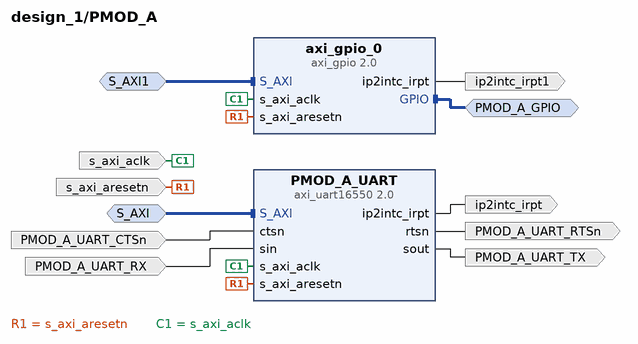
[diagram p3: block diagram inside /PMOD_A]
create_bd_intf_pin -mode Slave -vlnv xilinx.com:interface:aximm_rtl:1.0 S_AXI
create_bd_intf_pin -mode Master -vlnv xilinx.com:interface:gpio_rtl:1.0 PMOD_A_GPIO
create_bd_intf_pin -mode Slave -vlnv xilinx.com:interface:aximm_rtl:1.0 S_AXI1
create_bd_pin -dir I -type clk s_axi_aclk
create_bd_pin -dir I -type rst s_axi_aresetn
create_bd_pin -dir O -type intr ip2intc_irpt
create_bd_pin -dir I PMOD_A_UART_CTSn
create_bd_pin -dir O PMOD_A_UART_RTSn
create_bd_pin -dir I PMOD_A_UART_RX
create_bd_pin -dir O PMOD_A_UART_TX
create_bd_pin -dir O -type intr ip2intc_irpt1

create_bd_cell -type ip -vlnv xilinx.com:ip:axi_gpio:2.0 axi_gpio_0
set_property -dict {CONFIG.C_GPIO_WIDTH 4 CONFIG.C_INTERRUPT_PRESENT 1} [get_bd_cells axi_gpio_0]
create_bd_cell -type ip -vlnv xilinx.com:ip:axi_uart16550:2.0 PMOD_A_UART
set_property -dict {CONFIG.C_S_AXI_ACLK_FREQ_HZ 99999001} [get_bd_cells PMOD_A_UART]

# ---- hierarchy /PMOD_B ----
current_bd_instance /PMOD_B
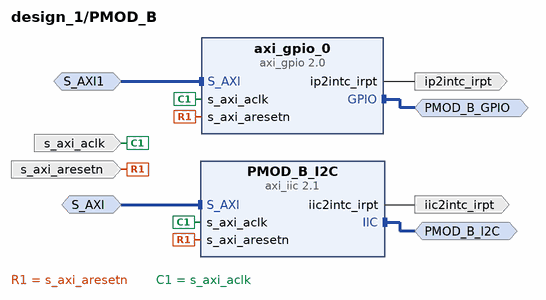
[diagram p4: block diagram inside /PMOD_B]
create_bd_intf_pin -mode Slave -vlnv xilinx.com:interface:aximm_rtl:1.0 S_AXI
create_bd_intf_pin -mode Master -vlnv xilinx.com:interface:iic_rtl:1.0 PMOD_B_I2C
create_bd_intf_pin -mode Master -vlnv xilinx.com:interface:gpio_rtl:1.0 PMOD_B_GPIO
create_bd_intf_pin -mode Slave -vlnv xilinx.com:interface:aximm_rtl:1.0 S_AXI1
create_bd_pin -dir I -type clk s_axi_aclk
create_bd_pin -dir I -type rst s_axi_aresetn
create_bd_pin -dir O -type intr iic2intc_irpt
create_bd_pin -dir O -type intr ip2intc_irpt

create_bd_cell -type ip -vlnv xilinx.com:ip:axi_gpio:2.0 axi_gpio_0
set_property -dict {CONFIG.C_GPIO_WIDTH 6 CONFIG.C_INTERRUPT_PRESENT 1} [get_bd_cells axi_gpio_0]
create_bd_cell -type ip -vlnv xilinx.com:ip:axi_iic:2.1 PMOD_B_I2C

# ---- connections ----

current_bd_instance /LVDS_Display
connect_bd_intf_net [get_bd_intf_pins S00_AXI] [get_bd_intf_pins ps8_0_axi_periph/S00_AXI]
connect_bd_intf_net [get_bd_intf_pins m_axi_mm_video1] [get_bd_intf_pins v_frmbuf_rd_1/m_axi_mm_video]
connect_bd_intf_net [get_bd_intf_pins lvds_display_touch_irq] [get_bd_intf_pins touch_panel_gpio/GPIO2]
connect_bd_intf_net [get_bd_intf_pins lvds_display_iic] [get_bd_intf_pins lvds_display_iic/IIC]
connect_bd_intf_net [get_bd_intf_pins lvds_display_iic] [get_bd_intf_pins system_ila_2/SLOT_0_IIC]
connect_bd_intf_net [get_bd_intf_pins ps8_0_axi_periph/M00_AXI] [get_bd_intf_pins v_frmbuf_rd_0/s_axi_CTRL]
connect_bd_intf_net [get_bd_intf_pins hls_ip_reset/S_AXI] [get_bd_intf_pins ps8_0_axi_periph/M01_AXI]
connect_bd_intf_net [get_bd_intf_pins ps8_0_axi_periph/M02_AXI] [get_bd_intf_pins v_tc_0/ctrl]
connect_bd_intf_net [get_bd_intf_pins lvds_display_iic/S_AXI] [get_bd_intf_pins ps8_0_axi_periph/M03_AXI]
connect_bd_intf_net [get_bd_intf_pins axi_gpio_0/S_AXI] [get_bd_intf_pins ps8_0_axi_periph/M04_AXI]
connect_bd_intf_net [get_bd_intf_pins ps8_0_axi_periph/M05_AXI] [get_bd_intf_pins v_mix_0/s_axi_CTRL]
connect_bd_intf_net [get_bd_intf_pins ps8_0_axi_periph/M06_AXI] [get_bd_intf_pins v_frmbuf_rd_1/s_axi_CTRL]
connect_bd_intf_net [get_bd_intf_pins ps8_0_axi_periph/M07_AXI] [get_bd_intf_pins backlight_pwm_timer/S_AXI]
connect_bd_intf_net [get_bd_intf_pins touch_panel_gpio/S_AXI] [get_bd_intf_pins ps8_0_axi_periph/M08_AXI]
connect_bd_intf_net [get_bd_intf_pins lvds_display_tx_0/vid] [get_bd_intf_pins v_axi4s_vid_out_0/vid_io_out]
connect_bd_intf_net [get_bd_intf_pins lvds_display_tx_0/vid] [get_bd_intf_pins system_ila_1/SLOT_1_VID_IO]
connect_bd_intf_net [get_bd_intf_pins m_axi_mm_video] [get_bd_intf_pins v_frmbuf_rd_0/m_axi_mm_video]
connect_bd_intf_net [get_bd_intf_pins v_frmbuf_rd_0/m_axis_video] [get_bd_intf_pins v_mix_0/s_axis_video2]
connect_bd_intf_net [get_bd_intf_pins v_frmbuf_rd_0/m_axis_video] [get_bd_intf_pins system_ila_0/SLOT_1_AXIS]
connect_bd_intf_net [get_bd_intf_pins v_frmbuf_rd_1/m_axis_video] [get_bd_intf_pins v_mix_0/s_axis_video1]
connect_bd_intf_net [get_bd_intf_pins v_frmbuf_rd_1/m_axis_video] [get_bd_intf_pins system_ila_0/SLOT_0_AXIS]
connect_bd_intf_net [get_bd_intf_pins v_axi4s_vid_out_0/video_in] [get_bd_intf_pins v_mix_0/m_axis_video]
connect_bd_intf_net [get_bd_intf_pins v_axi4s_vid_out_0/video_in] [get_bd_intf_pins system_ila_0/SLOT_2_AXIS]
connect_bd_intf_net [get_bd_intf_pins v_axi4s_vid_out_0/vtiming_in] [get_bd_intf_pins v_tc_0/vtiming_out]
connect_bd_intf_net [get_bd_intf_pins v_axi4s_vid_out_0/vtiming_in] [get_bd_intf_pins system_ila_1/SLOT_0_VIDEO_TIMING]
connect_bd_net [get_bd_pins axi_gpio_0/gpio_io_o] \
  [get_bd_pins axi_gpio_0/gpio_io_i] [get_bd_pins xlslice_0/Din] [get_bd_pins xlslice_1/Din] [get_bd_pins xlslice_2/Din]
connect_bd_net -net axi_timer_0_interrupt [get_bd_pins backlight_pwm_timer/interrupt] [get_bd_pins xlconcat_0/In6]
connect_bd_net -net axi_timer_0_pwm0 [get_bd_pins backlight_pwm_timer/pwm0] [get_bd_pins backlight_dctrl]
connect_bd_net [get_bd_pins hls_ip_reset/gpio_io_o] [get_bd_pins v_fb_rd_0_rst_n/Din] [get_bd_pins v_fb_rd_1_rst_n/Din] [get_bd_pins v_mix_rst_n/Din]
connect_bd_net [get_bd_pins lvds_display_iic/iic2intc_irpt] [get_bd_pins xlconcat_0/In2]
connect_bd_net [get_bd_pins lvds_display_tx_0/clkout_n] [get_bd_pins lvds_display_clk_n]
connect_bd_net [get_bd_pins lvds_display_tx_0/clkout_p] [get_bd_pins lvds_display_clk_p]
connect_bd_net [get_bd_pins lvds_display_tx_0/cmt_locked] [get_bd_pins system_ila_1/probe0]
connect_bd_net [get_bd_pins lvds_display_tx_0/dataout_n] [get_bd_pins lvds_display_data_n]
connect_bd_net [get_bd_pins lvds_display_tx_0/dataout_p] [get_bd_pins lvds_display_data_p]
connect_bd_net -net reset_1 [get_bd_pins display_reset] [get_bd_pins lvds_display_tx_0/reset]
connect_bd_net -net rst_ps8_0_199M_peripheral_aresetn [get_bd_pins m_axi_aresetn] \
  [get_bd_pins axi_gpio_0/s_axi_aresetn] [get_bd_pins hls_ip_reset/s_axi_aresetn] [get_bd_pins ps8_0_axi_periph/M00_ARESETN] \
  [get_bd_pins ps8_0_axi_periph/M01_ARESETN] [get_bd_pins ps8_0_axi_periph/M04_ARESETN] \
  [get_bd_pins ps8_0_axi_periph/M05_ARESETN] [get_bd_pins ps8_0_axi_periph/M06_ARESETN] [get_bd_pins system_ila_0/resetn]
connect_bd_net -net rst_ps8_0_99M_peripheral_aresetn [get_bd_pins s_axi_aresetn] \
  [get_bd_pins touch_panel_gpio/s_axi_aresetn] [get_bd_pins backlight_pwm_timer/s_axi_aresetn] \
  [get_bd_pins lvds_display_iic/s_axi_aresetn] [get_bd_pins ps8_0_axi_periph/ARESETN] \
  [get_bd_pins ps8_0_axi_periph/S00_ARESETN] [get_bd_pins ps8_0_axi_periph/M02_ARESETN] \
  [get_bd_pins ps8_0_axi_periph/M03_ARESETN] [get_bd_pins ps8_0_axi_periph/M07_ARESETN] \
  [get_bd_pins ps8_0_axi_periph/M08_ARESETN] [get_bd_pins v_tc_0/s_axi_aresetn]
connect_bd_net [get_bd_pins touch_panel_gpio/gpio_io_o] [get_bd_pins lvds_display_touch_reset]
connect_bd_net -net util_vector_logic_0_Res [get_bd_pins touch_panel_gpio/ip2intc_irpt] [get_bd_pins system_ila_2/probe0] [get_bd_pins xlconcat_0/In3]
connect_bd_net [get_bd_pins v_axi4s_vid_out_0/locked] [get_bd_pins system_ila_1/probe1]
connect_bd_net [get_bd_pins v_axi4s_vid_out_0/overflow] [get_bd_pins system_ila_0/probe0]
connect_bd_net [get_bd_pins v_axi4s_vid_out_0/underflow] [get_bd_pins system_ila_1/probe2]
connect_bd_net [get_bd_pins v_axi4s_vid_out_0/vtg_ce] [get_bd_pins v_tc_0/gen_clken]
connect_bd_net [get_bd_pins v_fb_rd_0_rst_n/Dout] [get_bd_pins v_frmbuf_rd_0/ap_rst_n]
connect_bd_net [get_bd_pins v_fb_rd_1_rst_n/Dout] [get_bd_pins v_frmbuf_rd_1/ap_rst_n]
connect_bd_net [get_bd_pins v_frmbuf_rd_0/interrupt] [get_bd_pins xlconcat_0/In0]
connect_bd_net [get_bd_pins v_frmbuf_rd_1/interrupt] [get_bd_pins xlconcat_0/In5]
connect_bd_net [get_bd_pins v_mix_0/interrupt] [get_bd_pins xlconcat_0/In4]
connect_bd_net [get_bd_pins v_tc_0/irq] [get_bd_pins xlconcat_0/In1]
connect_bd_net [get_bd_pins xlconcat_0/dout] [get_bd_pins lvds_display_irq]
connect_bd_net [get_bd_pins xlconstant_0/dout] [get_bd_pins v_mix_0/s_axis_video_TVALID]
connect_bd_net [get_bd_pins xlslice_0/Dout] [get_bd_pins lvds_display_reset]
connect_bd_net [get_bd_pins xlslice_1/Dout] [get_bd_pins lvds_display_standby]
connect_bd_net -net xlslice_2_Dout [get_bd_pins v_mix_rst_n/Dout] [get_bd_pins v_axi4s_vid_out_0/aresetn] [get_bd_pins v_mix_0/ap_rst_n]
connect_bd_net [get_bd_pins xlslice_2/Dout] [get_bd_pins pwr_en_ctrl]
connect_bd_net -net zynq_ultra_ps_e_0_pl_clk0 [get_bd_pins s_axi_aclk] \
  [get_bd_pins touch_panel_gpio/s_axi_aclk] [get_bd_pins backlight_pwm_timer/s_axi_aclk] \
  [get_bd_pins lvds_display_iic/s_axi_aclk] [get_bd_pins ps8_0_axi_periph/ACLK] [get_bd_pins ps8_0_axi_periph/S00_ACLK] \
  [get_bd_pins ps8_0_axi_periph/M02_ACLK] [get_bd_pins ps8_0_axi_periph/M03_ACLK] [get_bd_pins ps8_0_axi_periph/M07_ACLK] \
  [get_bd_pins ps8_0_axi_periph/M08_ACLK] [get_bd_pins system_ila_2/clk] [get_bd_pins v_tc_0/s_axi_aclk]
connect_bd_net -net zynq_ultra_ps_e_0_pl_clk1 [get_bd_pins m_axi_aclk] \
  [get_bd_pins axi_gpio_0/s_axi_aclk] [get_bd_pins hls_ip_reset/s_axi_aclk] [get_bd_pins ps8_0_axi_periph/M00_ACLK] \
  [get_bd_pins ps8_0_axi_periph/M01_ACLK] [get_bd_pins ps8_0_axi_periph/M04_ACLK] [get_bd_pins ps8_0_axi_periph/M05_ACLK] \
  [get_bd_pins ps8_0_axi_periph/M06_ACLK] [get_bd_pins system_ila_0/clk] [get_bd_pins v_axi4s_vid_out_0/aclk] \
  [get_bd_pins v_frmbuf_rd_0/ap_clk] [get_bd_pins v_frmbuf_rd_1/ap_clk] [get_bd_pins v_mix_0/ap_clk]
connect_bd_net -net zynq_ultra_ps_e_0_pl_clk2 [get_bd_pins display_clk] \
  [get_bd_pins lvds_display_tx_0/ref_clk] [get_bd_pins system_ila_1/clk] [get_bd_pins v_axi4s_vid_out_0/vid_io_out_clk] \
  [get_bd_pins v_tc_0/clk]

current_bd_instance /CLICK
connect_bd_intf_net [get_bd_intf_pins S_AXI2] [get_bd_intf_pins axi_iic_0/S_AXI]
connect_bd_intf_net [get_bd_intf_pins CLICK_I2C] [get_bd_intf_pins axi_iic_0/IIC]
connect_bd_intf_net -intf_net LVDS_Display_M08_AXI [get_bd_intf_pins S_AXI1] [get_bd_intf_pins CLICK_PWM_TIMER/S_AXI]
connect_bd_intf_net [get_bd_intf_pins S_AXI] [get_bd_intf_pins CLICK_UART/S_AXI]
connect_bd_net [get_bd_pins axi_iic_0/iic2intc_irpt] [get_bd_pins iic2intc_irpt]
connect_bd_net -net axi_timer_0_interrupt [get_bd_pins CLICK_PWM_TIMER/interrupt] [get_bd_pins interrupt]
connect_bd_net -net axi_timer_0_pwm0 [get_bd_pins CLICK_PWM_TIMER/pwm0] [get_bd_pins CLICK_PWM]
connect_bd_net -net axi_uart16550_1_ip2intc_irpt [get_bd_pins CLICK_UART/ip2intc_irpt] [get_bd_pins ip2intc_irpt]
connect_bd_net -net axi_uart16550_1_sout [get_bd_pins CLICK_UART/sout] [get_bd_pins CLICK_UART_TX]
connect_bd_net -net rst_ps8_0_99M_peripheral_aresetn [get_bd_pins s_axi_aresetn] \
  [get_bd_pins axi_iic_0/s_axi_aresetn] [get_bd_pins CLICK_PWM_TIMER/s_axi_aresetn] [get_bd_pins CLICK_UART/s_axi_aresetn]
connect_bd_net -net sin_0_2 [get_bd_pins CLICK_UART_RX] [get_bd_pins CLICK_UART/sin]
connect_bd_net -net zynq_ultra_ps_e_0_pl_clk0 [get_bd_pins s_axi_aclk] \
  [get_bd_pins axi_iic_0/s_axi_aclk] [get_bd_pins CLICK_PWM_TIMER/s_axi_aclk] [get_bd_pins CLICK_UART/s_axi_aclk]

current_bd_instance /PMOD_A
connect_bd_intf_net [get_bd_intf_pins PMOD_A_GPIO] [get_bd_intf_pins axi_gpio_0/GPIO]
connect_bd_intf_net [get_bd_intf_pins S_AXI1] [get_bd_intf_pins axi_gpio_0/S_AXI]
connect_bd_intf_net [get_bd_intf_pins S_AXI] [get_bd_intf_pins PMOD_A_UART/S_AXI]
connect_bd_net [get_bd_pins PMOD_A_UART/ip2intc_irpt] [get_bd_pins ip2intc_irpt]
connect_bd_net [get_bd_pins axi_gpio_0/ip2intc_irpt] [get_bd_pins ip2intc_irpt1]
connect_bd_net -net axi_uart16550_0_rtsn [get_bd_pins PMOD_A_UART/rtsn] [get_bd_pins PMOD_A_UART_RTSn]
connect_bd_net -net axi_uart16550_0_sout [get_bd_pins PMOD_A_UART/sout] [get_bd_pins PMOD_A_UART_TX]
connect_bd_net -net ctsn_0_1 [get_bd_pins PMOD_A_UART_CTSn] [get_bd_pins PMOD_A_UART/ctsn]
connect_bd_net -net rst_ps8_0_99M_peripheral_aresetn [get_bd_pins s_axi_aresetn] \
  [get_bd_pins axi_gpio_0/s_axi_aresetn] [get_bd_pins PMOD_A_UART/s_axi_aresetn]
connect_bd_net -net sin_0_1 [get_bd_pins PMOD_A_UART_RX] [get_bd_pins PMOD_A_UART/sin]
connect_bd_net -net zynq_ultra_ps_e_0_pl_clk0 [get_bd_pins s_axi_aclk] [get_bd_pins axi_gpio_0/s_axi_aclk] [get_bd_pins PMOD_A_UART/s_axi_aclk]

current_bd_instance /PMOD_B
connect_bd_intf_net [get_bd_intf_pins PMOD_B_GPIO] [get_bd_intf_pins axi_gpio_0/GPIO]
connect_bd_intf_net [get_bd_intf_pins S_AXI1] [get_bd_intf_pins axi_gpio_0/S_AXI]
connect_bd_intf_net -intf_net LVDS_Display_M10_AXI [get_bd_intf_pins S_AXI] [get_bd_intf_pins PMOD_B_I2C/S_AXI]
connect_bd_intf_net -intf_net PMOD_B_IIC_IIC [get_bd_intf_pins PMOD_B_I2C] [get_bd_intf_pins PMOD_B_I2C/IIC]
connect_bd_net -net PMOD_B_IIC_iic2intc_irpt [get_bd_pins PMOD_B_I2C/iic2intc_irpt] [get_bd_pins iic2intc_irpt]
connect_bd_net [get_bd_pins axi_gpio_0/ip2intc_irpt] [get_bd_pins ip2intc_irpt]
connect_bd_net -net rst_ps8_0_99M_peripheral_aresetn [get_bd_pins s_axi_aresetn] \
  [get_bd_pins axi_gpio_0/s_axi_aresetn] [get_bd_pins PMOD_B_I2C/s_axi_aresetn]
connect_bd_net -net zynq_ultra_ps_e_0_pl_clk0 [get_bd_pins s_axi_aclk] [get_bd_pins axi_gpio_0/s_axi_aclk] [get_bd_pins PMOD_B_I2C/s_axi_aclk]

current_bd_instance /
connect_bd_intf_net [get_bd_intf_ports CLICK_I2C] [get_bd_intf_pins CLICK/CLICK_I2C]
connect_bd_intf_net -intf_net LVDS_Display_GPIO2_0 [get_bd_intf_ports lvds_display_touch_irq] [get_bd_intf_pins LVDS_Display/lvds_display_touch_irq]
connect_bd_intf_net [get_bd_intf_ports lvds_display_iic] [get_bd_intf_pins LVDS_Display/lvds_display_iic]
connect_bd_intf_net [get_bd_intf_pins LVDS_Display/m_axi_mm_video] [get_bd_intf_pins smartconnect_0/S00_AXI]
connect_bd_intf_net [get_bd_intf_pins LVDS_Display/m_axi_mm_video1] [get_bd_intf_pins smartconnect_0/S01_AXI]
connect_bd_intf_net -intf_net PMODB_GPIO_0 [get_bd_intf_ports PMOD_B_GPIO] [get_bd_intf_pins PMOD_B/PMOD_B_GPIO]
connect_bd_intf_net [get_bd_intf_ports PMOD_A_GPIO] [get_bd_intf_pins PMOD_A/PMOD_A_GPIO]
connect_bd_intf_net -intf_net PMOD_B_IIC_IIC [get_bd_intf_ports PMOD_B_I2C] [get_bd_intf_pins PMOD_B/PMOD_B_I2C]
connect_bd_intf_net [get_bd_intf_pins LVDS_Display/S00_AXI] [get_bd_intf_pins ps8_0_axi_periph/M03_AXI]
connect_bd_intf_net [get_bd_intf_pins PMOD_B/S_AXI] [get_bd_intf_pins ps8_0_axi_periph/M09_AXI]
connect_bd_intf_net -intf_net axi_gpio_0_GPIO [get_bd_intf_ports dip_switches_8bits] [get_bd_intf_pins switch_gpio/GPIO]
connect_bd_intf_net -intf_net axi_gpio_1_GPIO [get_bd_intf_ports led_8bits] [get_bd_intf_pins led_gpio/GPIO]
connect_bd_intf_net -intf_net axi_gpio_2_GPIO [get_bd_intf_ports push_buttons_3bits] [get_bd_intf_pins button_gpio/GPIO]
connect_bd_intf_net [get_bd_intf_pins axi_intc_0/interrupt] [get_bd_intf_pins microblaze_riscv_0/INTERRUPT]
connect_bd_intf_net [get_bd_intf_pins axi_smc/M00_AXI] [get_bd_intf_pins axi_intc_0/s_axi]
connect_bd_intf_net [get_bd_intf_pins axi_smc/M01_AXI] [get_bd_intf_pins mdm_riscv_0/S_AXI]
connect_bd_intf_net [get_bd_intf_pins mdm_riscv_0/M_AXI] [get_bd_intf_pins smartconnect_0/S02_AXI]
connect_bd_intf_net [get_bd_intf_pins microblaze_riscv_0/M_AXI_DP] [get_bd_intf_pins axi_smc/S00_AXI]
connect_bd_intf_net [get_bd_intf_pins switch_gpio/S_AXI] [get_bd_intf_pins ps8_0_axi_periph/M00_AXI]
connect_bd_intf_net [get_bd_intf_pins led_gpio/S_AXI] [get_bd_intf_pins ps8_0_axi_periph/M01_AXI]
connect_bd_intf_net [get_bd_intf_pins button_gpio/S_AXI] [get_bd_intf_pins ps8_0_axi_periph/M02_AXI]
connect_bd_intf_net [get_bd_intf_pins ps8_0_axi_periph/M04_AXI] [get_bd_intf_pins CLICK/S_AXI]
connect_bd_intf_net [get_bd_intf_pins ps8_0_axi_periph/M05_AXI] [get_bd_intf_pins CLICK/S_AXI1]
connect_bd_intf_net [get_bd_intf_pins ps8_0_axi_periph/M06_AXI] [get_bd_intf_pins CLICK/S_AXI2]
connect_bd_intf_net [get_bd_intf_pins ps8_0_axi_periph/M07_AXI] [get_bd_intf_pins PMOD_A/S_AXI]
connect_bd_intf_net [get_bd_intf_pins ps8_0_axi_periph/M08_AXI] [get_bd_intf_pins PMOD_A/S_AXI1]
connect_bd_intf_net [get_bd_intf_pins ps8_0_axi_periph/M10_AXI] [get_bd_intf_pins PMOD_B/S_AXI1]
connect_bd_intf_net [get_bd_intf_pins smartconnect_0/M00_AXI] [get_bd_intf_pins zynq_ultra_ps_e_0/S_AXI_HP1_FPD]
connect_bd_intf_net [get_bd_intf_pins ps8_0_axi_periph/S00_AXI] [get_bd_intf_pins zynq_ultra_ps_e_0/M_AXI_HPM0_LPD]
connect_bd_net [get_bd_pins CLICK/iic2intc_irpt] [get_bd_pins IRQ0/In4]
connect_bd_net [get_bd_pins IRQ0/dout] [get_bd_pins zynq_ultra_ps_e_0/pl_ps_irq0]
connect_bd_net [get_bd_pins IRQ1/dout] [get_bd_pins zynq_ultra_ps_e_0/pl_ps_irq1]
connect_bd_net -net LVDS_Display_Dout_0 [get_bd_pins LVDS_Display/pwr_en_ctrl] [get_bd_ports pwr_en_ctrl]
connect_bd_net -net LVDS_Display_gpio_io_o_0 [get_bd_pins LVDS_Display/lvds_display_touch_reset] [get_bd_ports lvds_display_touch_reset]
connect_bd_net [get_bd_pins LVDS_Display/lvds_display_clk_n] [get_bd_ports lvds_display_clk_n]
connect_bd_net [get_bd_pins LVDS_Display/lvds_display_clk_p] [get_bd_ports lvds_display_clk_p]
connect_bd_net [get_bd_pins LVDS_Display/lvds_display_data_n] [get_bd_ports lvds_display_data_n]
connect_bd_net [get_bd_pins LVDS_Display/lvds_display_data_p] [get_bd_ports lvds_display_data_p]
connect_bd_net [get_bd_pins LVDS_Display/lvds_display_irq] [get_bd_pins IRQ1/In0]
connect_bd_net [get_bd_pins LVDS_Display/lvds_display_reset] [get_bd_ports lvds_display_reset]
connect_bd_net [get_bd_pins LVDS_Display/lvds_display_standby] [get_bd_ports lvds_display_standby]
connect_bd_net -net LVDS_Display_pwm0_0 [get_bd_pins LVDS_Display/backlight_dctrl] [get_bd_ports backlight_dctrl]
connect_bd_net -net PMODB_iic2intc_irpt [get_bd_pins PMOD_B/iic2intc_irpt] [get_bd_pins IRQ0/In7]
connect_bd_net [get_bd_pins PMOD_A/ip2intc_irpt] [get_bd_pins IRQ0/In5]
connect_bd_net [get_bd_pins PMOD_A/ip2intc_irpt1] [get_bd_pins IRQ0/In6]
connect_bd_net [get_bd_pins PMOD_B/ip2intc_irpt] [get_bd_pins IRQ1/In1]
connect_bd_net -net axi_gpio_0_ip2intc_irpt [get_bd_pins switch_gpio/ip2intc_irpt] [get_bd_pins IRQ0/In0]
connect_bd_net -net axi_gpio_2_ip2intc_irpt [get_bd_pins button_gpio/ip2intc_irpt] [get_bd_pins IRQ0/In1]
connect_bd_net -net axi_timer_0_interrupt [get_bd_pins CLICK/interrupt] [get_bd_pins IRQ0/In2]
connect_bd_net -net axi_timer_0_pwm0 [get_bd_pins CLICK/CLICK_PWM] [get_bd_ports CLICK_PWM]
connect_bd_net -net axi_uart16550_0_rtsn [get_bd_pins PMOD_A/PMOD_A_UART_RTSn] [get_bd_ports PMOD_A_UART_RTSn]
connect_bd_net -net axi_uart16550_0_sout [get_bd_pins PMOD_A/PMOD_A_UART_TX] [get_bd_ports PMOD_A_UART_TX]
connect_bd_net -net axi_uart16550_1_ip2intc_irpt [get_bd_pins CLICK/ip2intc_irpt] [get_bd_pins IRQ0/In3]
connect_bd_net -net axi_uart16550_1_sout [get_bd_pins CLICK/CLICK_UART_TX] [get_bd_ports CLICK_UART_TX]
connect_bd_net -net ctsn_0_1 [get_bd_ports PMOD_A_UART_CTSn] [get_bd_pins PMOD_A/PMOD_A_UART_CTSn]
connect_bd_net -net m_axi_aresetn_1 [get_bd_pins rst_ps8_0_200M/peripheral_aresetn] \
  [get_bd_pins LVDS_Display/m_axi_aresetn] [get_bd_pins smartconnect_0/aresetn]
connect_bd_net [get_bd_pins rst_ps8_0_100M/mb_reset] [get_bd_pins microblaze_riscv_0/Reset]
connect_bd_net [get_bd_pins rst_ps8_0_60M/peripheral_reset] [get_bd_pins LVDS_Display/display_reset]
connect_bd_net -net rst_ps8_0_99M_peripheral_aresetn [get_bd_pins rst_ps8_0_100M/peripheral_aresetn] \
  [get_bd_pins LVDS_Display/s_axi_aresetn] [get_bd_pins CLICK/s_axi_aresetn] [get_bd_pins PMOD_A/s_axi_aresetn] \
  [get_bd_pins PMOD_B/s_axi_aresetn] [get_bd_pins axi_intc_0/s_axi_aresetn] [get_bd_pins axi_smc/aresetn] \
  [get_bd_pins switch_gpio/s_axi_aresetn] [get_bd_pins led_gpio/s_axi_aresetn] [get_bd_pins button_gpio/s_axi_aresetn] \
  [get_bd_pins ps8_0_axi_periph/ARESETN] [get_bd_pins ps8_0_axi_periph/S00_ARESETN] \
  [get_bd_pins ps8_0_axi_periph/M00_ARESETN] [get_bd_pins ps8_0_axi_periph/M01_ARESETN] \
  [get_bd_pins ps8_0_axi_periph/M02_ARESETN] [get_bd_pins ps8_0_axi_periph/M03_ARESETN] \
  [get_bd_pins ps8_0_axi_periph/M04_ARESETN] [get_bd_pins ps8_0_axi_periph/M05_ARESETN] \
  [get_bd_pins ps8_0_axi_periph/M06_ARESETN] [get_bd_pins ps8_0_axi_periph/M07_ARESETN] \
  [get_bd_pins ps8_0_axi_periph/M08_ARESETN] [get_bd_pins ps8_0_axi_periph/M09_ARESETN] \
  [get_bd_pins ps8_0_axi_periph/M10_ARESETN] [get_bd_pins mdm_riscv_0/M_AXI_ARESETN] [get_bd_pins mdm_riscv_0/S_AXI_ARESETN]
connect_bd_net -net sin_0_1 [get_bd_ports PMOD_A_UART_RX] [get_bd_pins PMOD_A/PMOD_A_UART_RX]
connect_bd_net -net sin_0_2 [get_bd_ports CLICK_UART_RX] [get_bd_pins CLICK/CLICK_UART_RX]
connect_bd_net [get_bd_pins zynq_ultra_ps_e_0/pl_clk0] \
  [get_bd_pins LVDS_Display/s_axi_aclk] [get_bd_pins CLICK/s_axi_aclk] [get_bd_pins PMOD_A/s_axi_aclk] \
  [get_bd_pins PMOD_B/s_axi_aclk] [get_bd_pins microblaze_riscv_0/Clk] [get_bd_pins axi_smc/aclk] \
  [get_bd_pins axi_intc_0/s_axi_aclk] [get_bd_pins switch_gpio/s_axi_aclk] [get_bd_pins led_gpio/s_axi_aclk] \
  [get_bd_pins button_gpio/s_axi_aclk] [get_bd_pins ps8_0_axi_periph/ACLK] [get_bd_pins ps8_0_axi_periph/S00_ACLK] \
  [get_bd_pins ps8_0_axi_periph/M00_ACLK] [get_bd_pins ps8_0_axi_periph/M01_ACLK] [get_bd_pins ps8_0_axi_periph/M02_ACLK] \
  [get_bd_pins ps8_0_axi_periph/M03_ACLK] [get_bd_pins ps8_0_axi_periph/M04_ACLK] [get_bd_pins ps8_0_axi_periph/M05_ACLK] \
  [get_bd_pins ps8_0_axi_periph/M06_ACLK] [get_bd_pins ps8_0_axi_periph/M07_ACLK] [get_bd_pins ps8_0_axi_periph/M08_ACLK] \
  [get_bd_pins ps8_0_axi_periph/M09_ACLK] [get_bd_pins ps8_0_axi_periph/M10_ACLK] \
  [get_bd_pins rst_ps8_0_100M/slowest_sync_clk] [get_bd_pins zynq_ultra_ps_e_0/maxihpm0_lpd_aclk] \
  [get_bd_pins mdm_riscv_0/M_AXI_ACLK] [get_bd_pins smartconnect_0/aclk1] [get_bd_pins mdm_riscv_0/S_AXI_ACLK]
connect_bd_net [get_bd_pins zynq_ultra_ps_e_0/pl_clk1] \
  [get_bd_pins LVDS_Display/m_axi_aclk] [get_bd_pins rst_ps8_0_200M/slowest_sync_clk] [get_bd_pins smartconnect_0/aclk] \
  [get_bd_pins zynq_ultra_ps_e_0/saxihp1_fpd_aclk]
connect_bd_net [get_bd_pins zynq_ultra_ps_e_0/pl_clk2] [get_bd_pins LVDS_Display/display_clk] [get_bd_pins rst_ps8_0_60M/slowest_sync_clk]
connect_bd_net [get_bd_pins zynq_ultra_ps_e_0/pl_resetn0] \
  [get_bd_pins rst_ps8_0_100M/ext_reset_in] [get_bd_pins rst_ps8_0_200M/ext_reset_in] \
  [get_bd_pins rst_ps8_0_60M/ext_reset_in]
set_property PFM.AXI_PORT {  M_AXI_HPM1_FPD {memport "M_AXI_GP"}  S_AXI_HPC0_FPD {memport "S_AXI_HPC" sptag "HPC0" memory "zynq_ultra_ps_e_0 HPC0_DDR_LOW"}  S_AXI_HPC1_FPD {memport "S_AXI_HPC" sptag "HPC1" memory "zynq_ultra_ps_e_0 HPC1_DDR_LOW"}  S_AXI_HP0_FPD {memport "S_AXI_HP" sptag "HP0" memory "zynq_ultra_ps_e_0 HP0_DDR_LOW"}  S_AXI_HP1_FPD {memport "S_AXI_HP" sptag "HP1" memory "zynq_ultra_ps_e_0 HP1_DDR_LOW"}  S_AXI_HP2_FPD {memport "S_AXI_HP" sptag "HP2" memory "zynq_ultra_ps_e_0 HP2_DDR_LOW"}  S_AXI_HP3_FPD {memport "S_AXI_HP" sptag "HP3" memory "zynq_ultra_ps_e_0 HP3_DDR_LOW"}  } [get_bd_cells zynq_ultra_ps_e_0]
